# EasyEDA Pro project adapter_rfm95w_nrf242.eprj, board adapter_rfm95w_nrf24
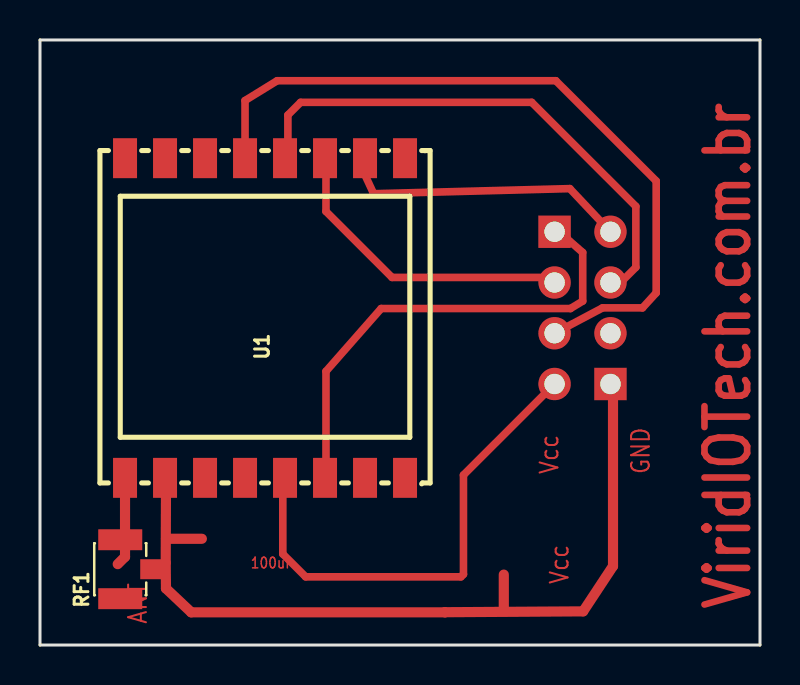
[diagram p1: board, top side]
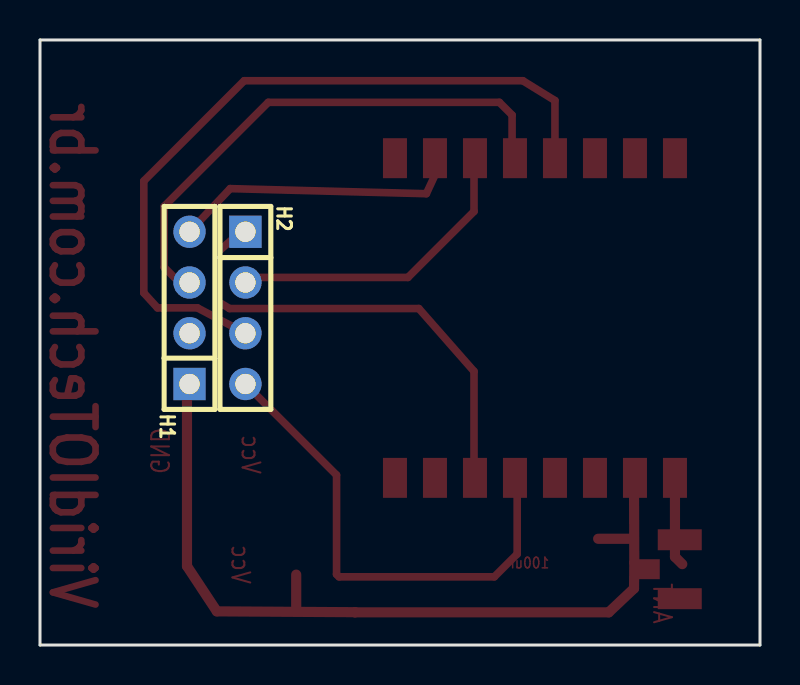
[diagram p2: board, bottom side, seen from below]

Outline 36 x 30.29 mm; copper layers: Top Layer, Bottom Layer. Coordinates in mm from the lower left corner of the outline.
Outline path: 0,30.29 36,30.29 36,0 0,0 0,30.29
Stack: Top Layer 0.035mm / Dielectric1 1.51mm FR4 er 4.5 / Bottom Layer 0.035mm

## Design rules (mm)
spacing safeClearance (default): track to track 0.152, other pairs 0.152 to 0.3
track width trackWidth (default): min 0.127, default 0.254, max 2.54
differential pair differentialPair (default): width min 0.127, default 0.254, max 2.54; gap min 0.152, default 0.152
via viaSize (default): diameter min 0.5, default 0.61, max 10; hole min 0.3, default 0.305, max 6

## Placement (name value [footprint] x y rotation side)
H1  HX PH254-01-04-Z-L11.5 straight pin header  [HDR-TH_4P-HX-PH254-01-04-Z-L11.5]  28.52 16.88 90 bottom
H2  HX PH254-01-04-Z-L11.5 straight pin header  [HDR-TH_4P-HX-PH254-01-04-Z-L11.5]  25.73 16.88 270 bottom
RF1  6GHz  [IPEX-SMD_3P-L2.6-W2.6-LS3.0_MHFIANTENNACONNECTOR]  4.78 3.8 90 top
U1  RFM95W-915S2  [WIRELM-SMD_16P-L16.0-W16.0-P2.00_LORA-CC68-915MHZ-TCXO]  11.25 16.37 270 top

## Footprints (pads in the part's own frame, mm; a bottom-side part is the same pattern mirrored in y, then rotated)
HDR-TH_4P-HX-PH254-01-04-Z-L11.5
  rect 1.62x1.62 hole 1.02: 1(-3.81,0)
  round 1.62 hole 1.02: 2(-1.27,0) 3(1.27,0) 4(3.81,0)
IPEX-SMD_3P-L2.6-W2.6-LS3.0_MHFIANTENNACONNECTOR
  rect 1x1.05 smd: 1(0,-0.762)
  rect 1.05x2.2 smd: 2(1.475,0.762) 3(-1.475,0.762)
WIRELM-SMD_16P-L16.0-W16.0-P2.00_LORA-CC68-915MHZ-TCXO
  rect 2x1.2 smd: 1(-8,7) 2(-8,5) 3(-8,3) 4(-8,1) 5(-8,-1) 6(-8,-3) 7(-8,-5) 8(-8,-7) 9(8,-7) 10(8,-5) 11(8,-3) 12(8,-1) 13(8,1) 14(8,3) 15(8,5) 16(8,7)

## Nets
As in the schematic.

Pads without a net: H1 2; U1 1 6 7 8 11 12 15 16

## Routing (per net, layer and track width the routed paths; a pad name or vN(x,y) marks a point on that pad's centre or on a via; arc(x,y) is an arc through that point)
SCK: length 26.5
  Top Layer w0.381: 28.52,18.17 29.05,18.17 29.79,18.91 29.79,21.96 24.59,27.16 13.03,27.16 12.4,26.53 12.4,24.64 12.25,24.5
$1N1589: length 4.8
  Top Layer w0.254: 4.39,8.35 4.25,8.5
  Top Layer w0.508: 4.25,8.5 4.25,4.41 3.89,4.05
3.3V: length 24.2
  Top Layer w0.381: 12.14,7.61 12.14,4.56 13.28,3.41 21.05,3.41 21.17,3.54 21.17,8.51 25.86,13.19
GND: length 41.5
  Top Layer w0.508: 6.3,7.86 6.29,4.13 6.3,2.83 7.56,1.64 20.25,1.64 20.25,1.64 27.16,1.69 28.65,3.95 28.65,12.77 ; 8.09,5.32 6.3,5.32 ; 23.19,3.53 23.19,1.76
DIO0: length 23.4
  Top Layer w0.381: 14.3,9 14.3,13.7 17.06,16.84 26.52,16.84 27.14,17.22 27.14,19.65 25.73,20.88
MISO: length 14.4
  Top Layer w0.381: 16,24.07 16.68,22.59 26.49,22.84 H1.4
MOSI: length 15.4
  Top Layer w0.381: 14.3,24.66 14.3,21.7 17.6,18.4 25.35,18.4
NSS: length 36.7
  Top Layer w0.381: 10.25,24.75 10.25,27.25 11.86,28.24 25.79,28.24 30.81,23.23 30.81,17.63 30.12,16.88 28.13,16.88 H2.3

## Text on the board
Top Layer: 100uf | ANT | Vcc | GND | ViridIOTech.com.br
